# EAGLE design esplay_2.0 (EAGLE 9.2.2)
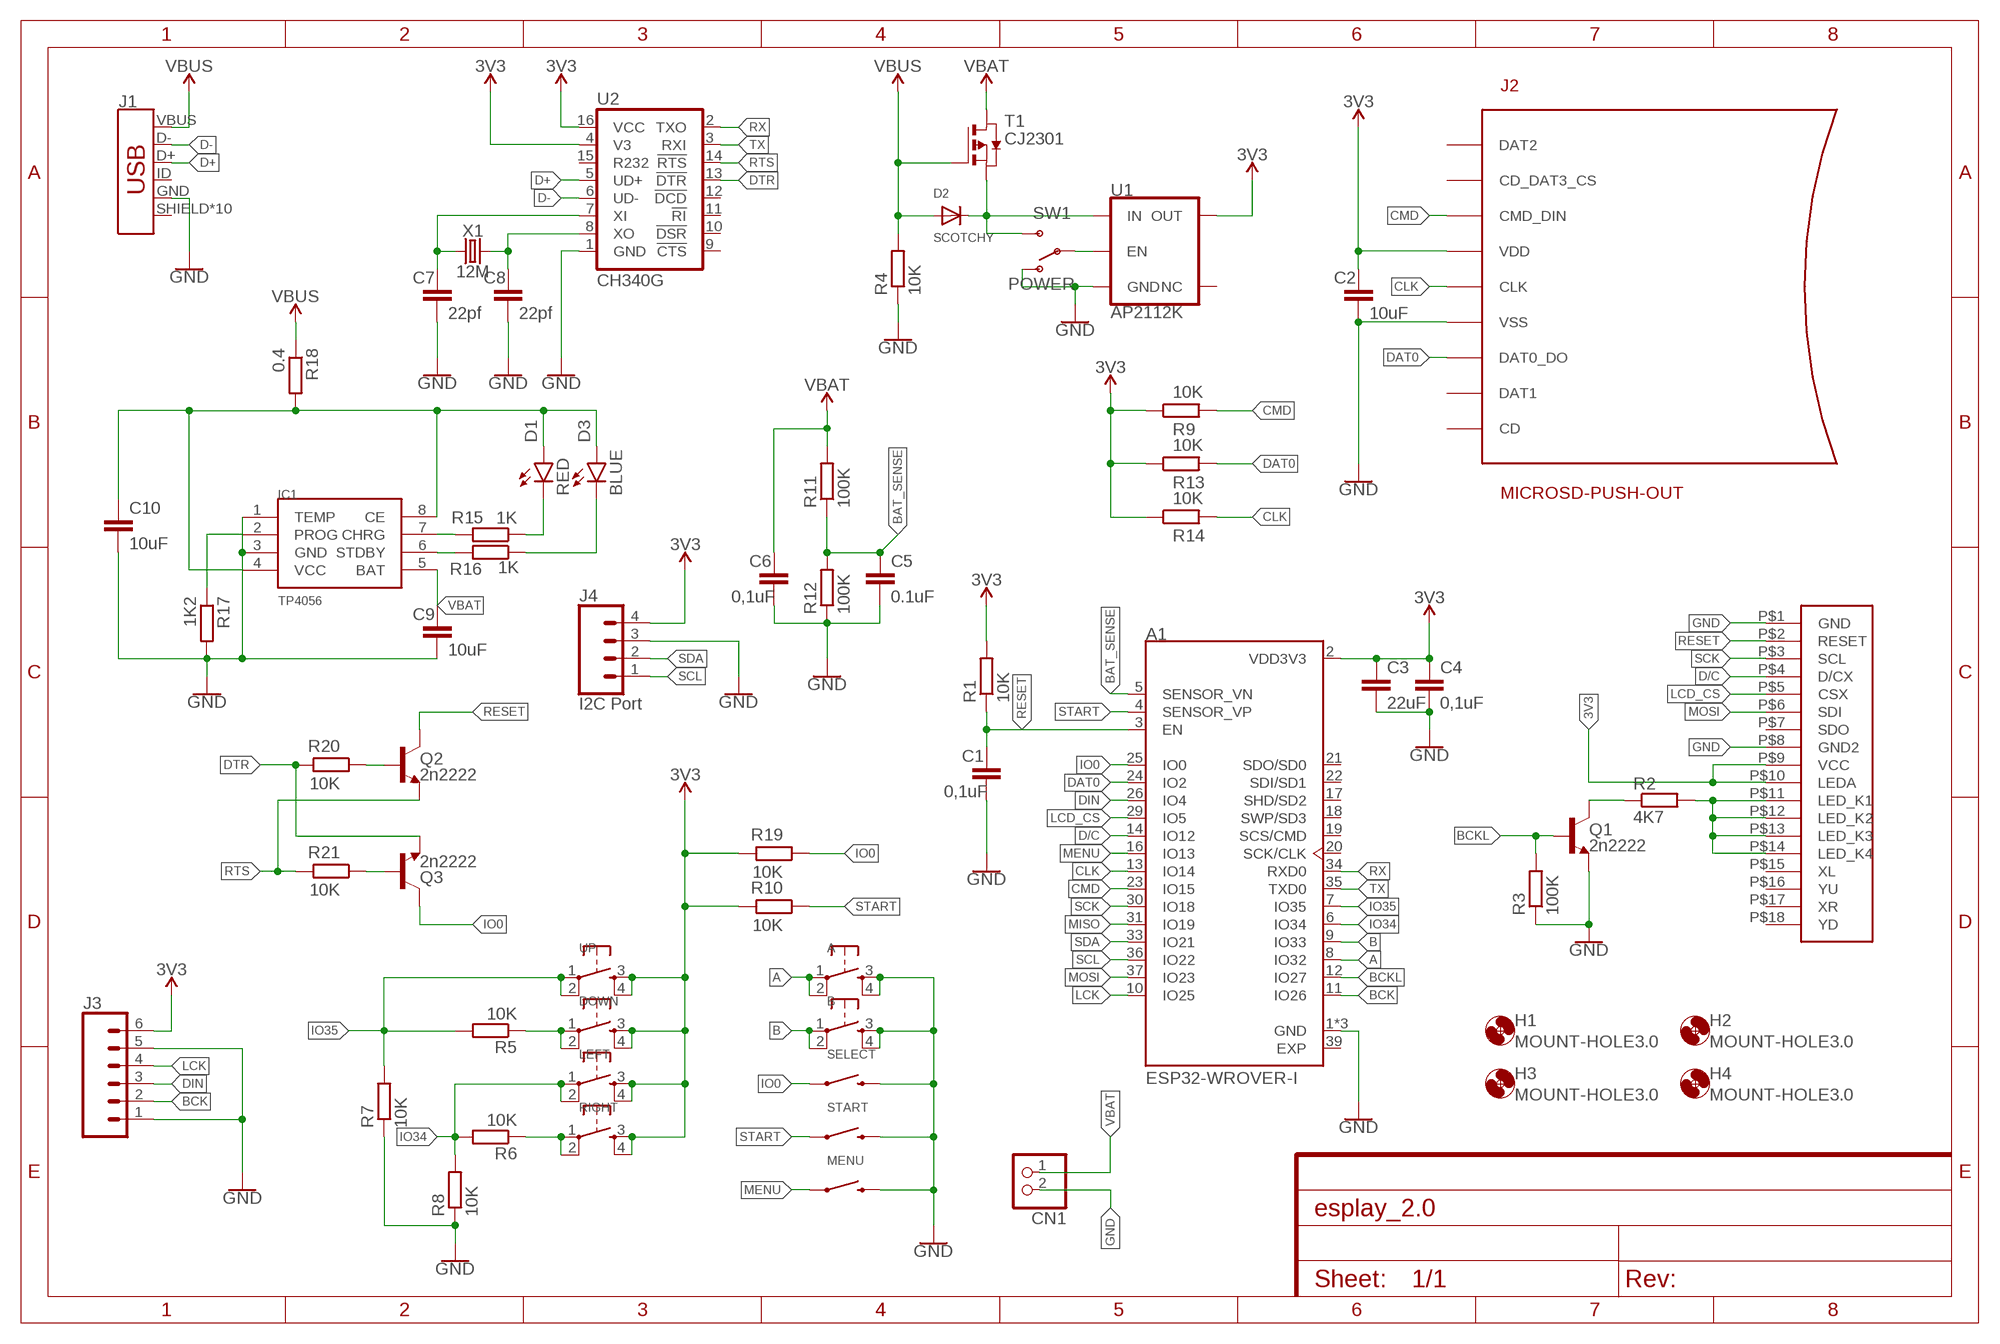
[diagram p0: schematic, sheet 1]

## Parts
A  MOMENTARY-SWITCH-SPST-2-SMD-5.2MM  [TACTILE_SWITCH_SMD_5.2MM]
A1  ESP32-WROVER-I  [XCVR_ESP32-WROVER-I]
B  MOMENTARY-SWITCH-SPST-2-SMD-5.2MM  [TACTILE_SWITCH_SMD_5.2MM]
C1  0,1uF  C  [C0805]
C2  10uF  C  [C0805]
C3  22uF  C  [C0805]
C4  0,1uF  C  [C0805]
C5  0.1uF  C  [C0805]
C6  0,1uF  C  [C0805]
C7  22pf  C  [C0805]
C8  22pf  C  [C0805]
C9  10uF  C  [C0805]
C10  10uF  C  [C0805]
CN1  JST_2PIN-SMT-RA  [JST-PH-2-SMT-RA]
D1  RED  LED-RED0603  [LED-0603]
D2  SCOTCHY  DIODESMA  [SMADIODE]
D3  BLUE  LED-BLUE0603  [LED-0603]
DOWN  MOMENTARY-SWITCH-SPST-2-SMD-5.2MM  [TACTILE_SWITCH_SMD_5.2MM]
H1  MOUNT-HOLE3.0  [3,0]
H2  MOUNT-HOLE3.0  [3,0]
H3  MOUNT-HOLE3.0  [3,0]
H4  MOUNT-HOLE3.0  [3,0]
IC1  TP4056  [SOP-8]
J1  USB_MICRO-B_HALF_PTH_MILL  [USB-MICROB-PTH-MILL]
J2  MICROSD-PUSH-OUT  [MICROSD-PUSH-OUT]
J3  CONN_06LOCK  [1X06_LOCK]
J4  I2C Port  CONN_04JST-PTH  [JST-4-PTH]
LEFT  MOMENTARY-SWITCH-SPST-2-SMD-5.2MM  [TACTILE_SWITCH_SMD_5.2MM]
MENU  MOMENTARY-SWITCH-SPST-SMD-6.0X3.5MM  [TACTILE_SWITCH_SMD_6.0X3.5MM]
Q1  2n2222  TRANS_NPN-MMBT2222AL  [SOT23-3]
Q2  2n2222  TRANS_NPN-MMBT2222AL  [SOT23-3]
Q3  2n2222  TRANS_NPN-MMBT2222AL  [SOT23-3]
R1  10K  R  [R0805]
R2  4K7  R  [R0805]
R3  100K  R  [R0805]
R4  10K  R  [R0805]
R5  10K  R  [R0805]
R6  10K  R  [R0805]
R7  10K  R  [R0805]
R8  10K  R  [R0805]
R9  10K  R  [R0805]
R10  10K  R  [R0805]
R11  100K  R  [R0805]
R12  100K  R  [R0805]
R13  10K  R  [R0805]
R14  10K  R  [R0805]
R15  1K  R  [R0805]
R16  1K  R  [R0805]
R17  1K2  R  [R0805]
R18  0.4  R  [R0805]
R19  10K  R  [R0805]
R20  10K  R  [R0805]
R21  10K  R  [R0805]
RIGHT  MOMENTARY-SWITCH-SPST-2-SMD-5.2MM  [TACTILE_SWITCH_SMD_5.2MM]
SELECT  MOMENTARY-SWITCH-SPST-SMD-6.0X3.5MM  [TACTILE_SWITCH_SMD_6.0X3.5MM]
START  MOMENTARY-SWITCH-SPST-SMD-6.0X3.5MM  [TACTILE_SWITCH_SMD_6.0X3.5MM]
SW1  POWER  SWITCH_SPDT  [KPS-1290]
T1  CJ2301  PMOSSOT23  [SOT-23]
TFT_DISPLAY  ILI9341-2.4  [ILI9341-2.4]
U1  AP2112K  V_REG_AP2112K-3.3V  [SOT23-5]
U2  CH340G  CH340GSMD  [SO016]
UP  MOMENTARY-SWITCH-SPST-2-SMD-5.2MM  [TACTILE_SWITCH_SMD_5.2MM]
X1  12M  CRYSTALSMD-2X6  [CRYSTAL-SMD-2X6-CYL]

## Nets
3V3 [3V3]: A1.2(VDD3V3) C2.1 C3.1 C4.1 DOWN.3 DOWN.4 J2.4(VDD) J3.6 J4.4 LEFT.3 LEFT.4 R1.2 R9.1 R10.2 R13.1 R14.1 R19.2 RIGHT.3 RIGHT.4 TFT_DISPLAY.P$9(VCC) TFT_DISPLAY.P$10(LEDA) U1.5(OUT) U2.4(V3) U2.16(VCC) UP.3 UP.4
A: A1.8(IO32) A.1 A.2
B: A1.9(IO33) B.1 B.2
BAT_SENSE: A1.5(SENSOR_VN) C5.1 R11.1 R12.2
BCK: A1.11(IO26) J3.2
BCKL: A1.12(IO27) Q1.1(B) R3.2
CLK: A1.13(IO14) J2.5(CLK) R14.2
CMD: A1.23(IO15) J2.3(CMD_DIN) R9.2
D+: J1.D+ U2.5(UD+)
D-: J1.D- U2.6(UD-)
D/C: A1.14(IO12) TFT_DISPLAY.P$4(D/CX)
DAT0: A1.24(IO2) J2.7(DAT0_DO) R13.2
DIN: A1.26(IO4) J3.3
DTR: Q3.2(E) R20.2 U2.13(!DTR)
GND: A1.1(GND) A1.15(GND) A1.38(GND) A.3 A.4 B.3 B.4 C1.2 C2.2 C3.2 C4.2 C5.2 C6.2 C7.2 C8.2 C9.2 C10.2 CN1.2 IC1.1(TEMP) IC1.3(GND) J1.GND J2.6(VSS) J2.G1(VSS) J2.G2(VSS) J2.G3(VSS) J2.G4(VSS) J3.1 J3.5 J4.3 MENU.2 Q1.2(E) R3.1 R4.1 R7.1 R8.1 R12.1 R17.2 SELECT.2 START.2 SW1.O TFT_DISPLAY.P$1(GND) TFT_DISPLAY.P$8(GND2) U1.2(GND) U2.1(GND)
IO0: A1.25(IO0) Q3.3(C) R19.1 SELECT.1
IO34: A1.6(IO34) LEFT.1 LEFT.2 R6.2 R8.2
IO35: A1.7(IO35) R5.2 R7.2 UP.1 UP.2
LCD_CS: A1.29(IO5) TFT_DISPLAY.P$5(CSX)
LCK: A1.10(IO25) J3.4
MENU: A1.16(IO13) MENU.1
MISO: A1.31(IO19)
MOSI: A1.37(IO23) TFT_DISPLAY.P$6(SDI)
N$1: D2.C SW1.S T1.2(S) U1.1(IN)
N$2: R2.2 TFT_DISPLAY.P$11(LED_K1) TFT_DISPLAY.P$12(LED_K2) TFT_DISPLAY.P$13(LED_K3) TFT_DISPLAY.P$14(LED_K4)
N$3: SW1.P U1.3(EN)
N$4: Q1.3(C) R2.1
N$5: C7.1 U2.7(XI) X1.X1
N$6: C8.1 U2.8(XO) X1.X2
N$7: R6.1 RIGHT.1 RIGHT.2
N$8: DOWN.1 DOWN.2 R5.1
N$9: IC1.2(PROG) R17.1
N$10: IC1.7(CHRG) R15.2
N$11: IC1.6(STDBY) R16.2
N$12: D1.C R15.1
N$13: D3.C R16.1
N$14: C10.1 D1.A D3.A IC1.4(VCC) IC1.8(CE) R18.2
N$15: Q2.1(B) R20.1
N$16: Q3.1(B) R21.1
RESET: A1.3(EN) C1.1 Q2.3(C) R1.1 TFT_DISPLAY.P$2(RESET)
RTS: Q2.2(E) R21.2 U2.14(!RTS)
RX: A1.34(RXD0) U2.2(TXO)
SCK: A1.30(IO18) TFT_DISPLAY.P$3(SCL)
SCL: A1.36(IO22) J4.1
SDA: A1.33(IO21) J4.2
START: A1.4(SENSOR_VP) R10.1 START.1
TX: A1.35(TXD0) U2.3(RXI)
VBAT [3V3]: C6.1 C9.1 CN1.1 IC1.5(BAT) R11.2 T1.1(D)
VBUS [VBUS]: D2.A J1.VBUS R4.2 R18.1 T1.3(G)
Unconnected: A1.17(SHD/SD2) A1.18(SWP/SD3) A1.19(SCS/CMD) A1.20(SCK/CLK) A1.21(SDO/SD0) A1.22(SDI/SD1) J1.ID J1.SHIELD J1.SHIELD2(SHIELD) J1.SHIELD3(SHIELD) J1.SHIELD4(SHIELD) J1.SHIELD5(SHIELD) J1.SHIELD6(SHIELD) J1.SHIELD7(SHIELD) J1.SHIELD8(SHIELD) J1.SHIELD9(SHIELD) J1.SHIELD10(SHIELD) J2.1(DAT2) J2.2(CD_DAT3_CS) J2.8(DAT1) J2.CD TFT_DISPLAY.P$7(SDO) TFT_DISPLAY.P$15(XL) TFT_DISPLAY.P$16(YU) TFT_DISPLAY.P$17(XR) TFT_DISPLAY.P$18(YD) U1.4(NC) U2.9(!CTS) U2.10(!DSR) U2.11(!RI) U2.12(!DCD) U2.15(R232)

## Power pins joined to a net without a drawn wire
EXP: A1.39(EXP)

## Library data of the parts
A B DOWN LEFT RIGHT UP = SparkFun-Switches:MOMENTARY-SWITCH-SPST-2: Momentary Switch (Pushbutton) - SPST - Two Circuits Normally-open (NO) SPST momentary switches (buttons, pushbuttons). Schematic symbol includes two switch circuits. Variants SMD-4.6MMX2.8MM - 4.60mm x 2.80mm Tactile Momentary Button Switch - Used on SparkFun SAMD21 Mini Breakout <https://www.sparkfun.com/products/13664> SMD-5.2MM - Mini Pushbutton Switch - SMD <https://www.sparkfun.com/products/8720> - Used on Arduino Pro Mini <https://www.sparkfun.com/products/11114>; PROD_ID: SWCH-08247; SF_SKU: COM-08720
A1 = ESP32-WROVER-I:ESP32-WROVER-I: Module: combo; GPIO, I2C x2, I2S x2, SDIO, SPI x3, UART x3; U.FL; AVAILABILITY: Unavailable; DESCRIPTION: Module: combo; GPIO, I2C x2, I2S x2, SDIO, SPI x3, UART x3; U.FL; MF: Espressif Systems; MP: ESP32-WROVER-I; PACKAGE: Module Espressif Systems; PRICE: None
C1-C10 = eagle-ltspice:C: CAPACITOR, European symbol; SPICEMODEL: NONE; SPICEPREFIX: C
CN1 = adafruit:JST_2PIN: JST 2-Pin Connectors of various flavors SMT-RA (S2B-PH-SM4) 4UConnector #17311 SMT (B2B-PH-SM4) THM-RA (S2B-PH) THM (B2B-PH)
D1 = SparkFun-LED:LED-RED: Red SMD LED Used in manufacturing of most products at SparkFun Packages: 0603 - SMD 0603 package [Product Link] <http://docs.avagotech.com/docs/AV02-0551EN> 0603 SMART - SMD 0603 SMART package ( more efficient and expensive)[Product Link] <http://www.osram-os.com/Graphics/XPic2/00077099_0.pdf> 1206 - SMD1206 package [Product Link] <https://www.sparkfun.com/datasheets/DevTools/LilyPad/Q150OVS4.pdff> SparkFun Products: Pro Mini 328 -5V <https://www.sparkfun.com/products/821> RedBoard <https://www.sparkfun.com/products/12757> IOIO-OTG <https://www.sparkfun.com/products/13613>; PROD_ID: DIO-00819
D2 = adafruit:DIODE: Diode SMADIODE - SMA Surface Mount Package 20V 1A Schottky Diode Digikey: 641-1014-6-ND DO-1N4148 - Through Hole Small Current Diode SOD-123 20V 1 A (.5mV Vf) Schottky Diode - Digikey: MBRX120TPMSCT-ND SOD-323 10V 570mA (.38mV Vf, 3ns) Schottky Diode - Digikey: ZLLS410CT-ND SOD-523 30V 30mA Schottky Diode (RB751S-40TE61) - Digikey: RB751S-40TE61CT-ND SOT23-R/W - SOT23 Package (R = Solder Paste/Reflow Ovens, W = Hand-Soldering) BAT54Film 40V 300mA - Digikey: 497-7162-1-ND
D3 = SparkFun-LED:LED-BLUE: Blue SMD LED Used in manufacturing of various products at SparkFun Packages: 0603 - SMD 0603 package [Product Link] <http://www.digikey.com/product-detail/en/SMLE12BC7TT86/511-1589-2-ND/1641808> 1206 - SMD1206 package [Product Link] <http://www.digikey.com/product-detail/en/lite-on-inc/LTST-C150TBKT/160-1643-1-ND/573584> SparkFun Products: ESP8266 Thing-Dev Board <https://www.sparkfun.com/products/13711> RedBoard <https://www.sparkfun.com/products/12757>; PROD_ID: DIO-08575
H1-H4 = holes:MOUNT-HOLE: MOUNTING HOLE with drill center marker
IC1 = TP4056:TP4056
J1 = SparkFun-Connectors:USB_MICRO-B: USB Type Micro-B Connector Male/female and PTH/SMT variants SparkFun Products: SparkFun microB USB Breakout <https://www.sparkfun.com/products/12035> SparkFun USB microB Plug Breakout <https://www.sparkfun.com/products/10031> SparkFun ESP8266 Thing <https://www.sparkfun.com/products/13231>; PROD_ID: CONN-13711
J2 = microsd:MICROSD-PUSH-OUT: T-Flash Push-Out Micro SD Card Reader 14.75mm x 14.5mm SMD with external pins
J3 = SparkFun-Connectors:CONN_06: Multi connection point. Often used as Generic Header-pin footprint for 0.1 inch spaced/style header connections On any of the 0.1 inch spaced packages, you can populate with these: Break Away Headers - Straight <https://www.sparkfun.com/products/116> (PRT-00116) Break Away Male Headers - Right Angle <https://www.sparkfun.com/products/553> (PRT-00553) Female Headers <https://www.sparkfun.com/products/115> (PRT-00115) Break Away Headers - Machine Pin <https://www.sparkfun.com/products/117> (PRT-00117) Break Away Female Headers - Swiss Machine Pin <https://www.sparkfun.com/products/743> (PRT-00743) Arduino Stackable Header - 6 Pin <https://www.sparkfun.com/products/9280> (PRT-09280) For SCREWTERMINALS and SPRING TERMINALS visit here: Screw Terimnals on SparkFun.com <https://www.sparkfun.com/search/results?term=Screw+Terminals> (5mm/3.5mm/2.54mm spacing) This device is also useful as a general connection point to wire up your design to another part of your project. Our various solder wires solder well into these plated through hole pads. Hook-Up Wire - Assortment (Stranded, 22 AWG) <https://www.sparkfun.com/products/11375> (PRT-11375) Hook-Up Wire - Assortment (Solid Core, 22 AWG) <https://www.sparkfun.com/products/11367> (PRT-11367) View the entire wire category on our website here <https://www.sparkfun.com/categories/141>
J4 = SparkFun-Connectors:CONN_04: Multi connection point. Often used as Generic Header-pin footprint for 0.1 inch spaced/style header connections On any of the 0.1 inch spaced packages, you can populate with these: Break Away Headers - Straight <https://www.sparkfun.com/products/116> (PRT-00116) Break Away Male Headers - Right Angle <https://www.sparkfun.com/products/553> (PRT-00553) Female Headers <https://www.sparkfun.com/products/115> (PRT-00115) Break Away Headers - Machine Pin <https://www.sparkfun.com/products/117> (PRT-00117) Break Away Female Headers - Swiss Machine Pin <https://www.sparkfun.com/products/743> (PRT-00743) For SCREWTERMINALS and SPRING TERMINALS visit here: Screw Terimnals on SparkFun.com <https://www.sparkfun.com/search/results?term=Screw+Terminals> (5mm/3.5mm/2.54mm spacing) This device is also useful as a general connection point to wire up your design to another part of your project. Our various solder wires solder well into these plated through hole pads. Hook-Up Wire - Assortment (Stranded, 22 AWG) <https://www.sparkfun.com/products/11375> (PRT-11375) Hook-Up Wire - Assortment (Solid Core, 22 AWG) <https://www.sparkfun.com/products/11367> (PRT-11367) View the entire wire category on our website here <https://www.sparkfun.com/categories/141> Special notes: Molex polarized connector foot print use with SKU : PRT-08231 with associated crimp pins and housings. 1MM SMD Version SKU: PRT-10208; PROD_ID: WIRE-13531; SF_ID: PRT-09916
MENU SELECT START = SparkFun-Switches:MOMENTARY-SWITCH-SPST: Momentary Switch (Pushbutton) - SPST Normally-open (NO) SPST momentary switches (buttons, pushbuttons). Variants PTH-12MM - 12mm square, through-hole Momentary Pushbutton Switch - 12mm Square <https://www.sparkfun.com/products/9190> (COM-09190) PTH-6.0MM, PTH-6.0MM-KIT - 6.0mm square, through-hole Mini Pushbutton Switch <https://www.sparkfun.com/products/97> (COM-00097) KIT package intended for soldering kit's - only one side of pads' copper is exposed. PTH-RIGHT-ANGLE-KIT - Right-angle, through-hole Right Angle Tactile Button <https://www.sparkfun.com/products/10791> - Used on SparkFun BigTime Watch Kit <https://www.sparkfun.com/products/11734> SMD-12MM - 12mm square, surface-mount Tactile Button - SMD (12mm) <https://www.sparkfun.com/products/12993> (COM-12993) Used on SparkFun PicoBoard <https://www.sparkfun.com/products/11888> SMD-4.5MM - 4.5mm Square Trackball Switch Used on SparkFun Blackberry Trackballer Breakout <https://www.sparkfun.com/products/13169> SMD-4.6MMX2.8MM - 4.60mm x 2.80mm, surface mount Used on SparkFun SAMD21 Mini Breakout <https://www.sparkfun.com/products/13664> SMD-5.2MM, SMD-5.2-REDUNDANT - 5.2mm square, surface-mount Mini Pushbutton Switch - SMD <https://www.sparkfun.com/products/8720> (COM-08720) Used on Arduino Pro Mini <https://www.sparkfun.com/products/11114> REDUNDANT package connects both switch circuits together SMD-6.0X3.5MM - 6.0 x 3.5mm, surface mount Momentary Reset Switch SMD <https://www.sparkfun.com/products/8229> (COM-08229) SMD-6.2MM-TALL - 6.2mm square, surface mount Tactile Button - SMD (6mm) <https://www.sparkfun.com/products/12992> Used on SparkFun Digital Sandbox <https://www.sparkfun.com/products/12651> SMD-RIGHT-ANGLE - Right-angle, surface mount Used on SparkFun Block for Intel® Edison - Arduino <https://www.sparkfun.com/products/13036>; PROD_ID: SWCH-00815; SF_SKU: COM-08229
Q1-Q3 = SparkFun-DiscreteSemi:TRANS_NPN: NPN transistor Current controlled devices typically used to amplify current or used as a switch. BC547 - COM-08928 <http://www.sparkfun.com/products/8928> (TO-92 45V 100mA) (1.Collector 2.Base 3.Emitter) 2N3904 - COM-00521 <http://www.sparkfun.com/products/521> (TO-92 40V 200mA) (1.Emitter 2.Base 3.Collector) P2N2222A - COM-12852 <http://www.sparkfun.com/products/12852> (TO-92 40V 600mA) (1.Collector 2.Base 3.Emitter); PROD_ID: TRANS-08049; VALUE: 600mA/40V
R1-R21 = eagle-ltspice:R: RESISTOR, European symbol; SPICEMODEL: NONE; SPICEPREFIX: R
SW1 = SparkFun-Retired:SWITCH_SPDT: SWCH-10651 Side-actuated SPDT slide switch, as used on the Arduino Pro; PROD_ID: SWCH-10651
T1 = zetex:PMOSSOT23: MOS FET; OC_FARNELL: unknown; OC_NEWARK: unknown
TFT_DISPLAY = TFTDisplays:ILI9341-2.4
U1 = SparkFun-IC-Power:V_REG_AP2112: AP2112 - 600mA CMOS LDO Regulator w/ Enable The AP2112 is CMOS process low dropout linear regulator with enable function, the regulator delivers a guaranteed 600mA (min.) continuous load current. Features Output Voltage Accuracy: ±1.5% Output Current: 600mA (Min.) Foldback Short Current Protection: 50mA Enable Function to Turn ON/OFF VOUT Low Dropout Voltage (3.3V): 250mV (Typ.) @IOUT=600mA Excellent Load Regulation: 0.2%/A (Typ.) Excellent Line Regulation: 0.02%/V (Typ.) Low Quiescent Current: 55μA (Typ.) Low Standby Current: 0.01μA (Typ.) Low Output Noise: 50μVRMS PSRR: 100Hz -65dB, 1kHz -65dB OTSD Protection Stable with 1.0μF Flexible Cap: Ceramic, Tantalum and Aluminum Electrolytic Operation Temperature Range: -40°C to 85°C ESD: MM 400V, HBM 4000V; PROD_ID: VREG-12457; VALUE: 3.3V
U2 = SparkFun-IC-Comms:CH340G: A simple USB 2.0 to Serial IC.; PROD_ID: IC-13498
X1 = SparkFun-Clocks:CRYSTAL: Crystals (Generic) These are passive quartz crystals, which can be used as a clock source for a microcontroller. Crystal's are two-terminal devices. They require external "load" capacitors to generate an oscillating signal.

## Net classes
0 default: width 0.305 mm
1 VBUS: width 0.406 mm
2 3V3: width 0.406 mm

## Board
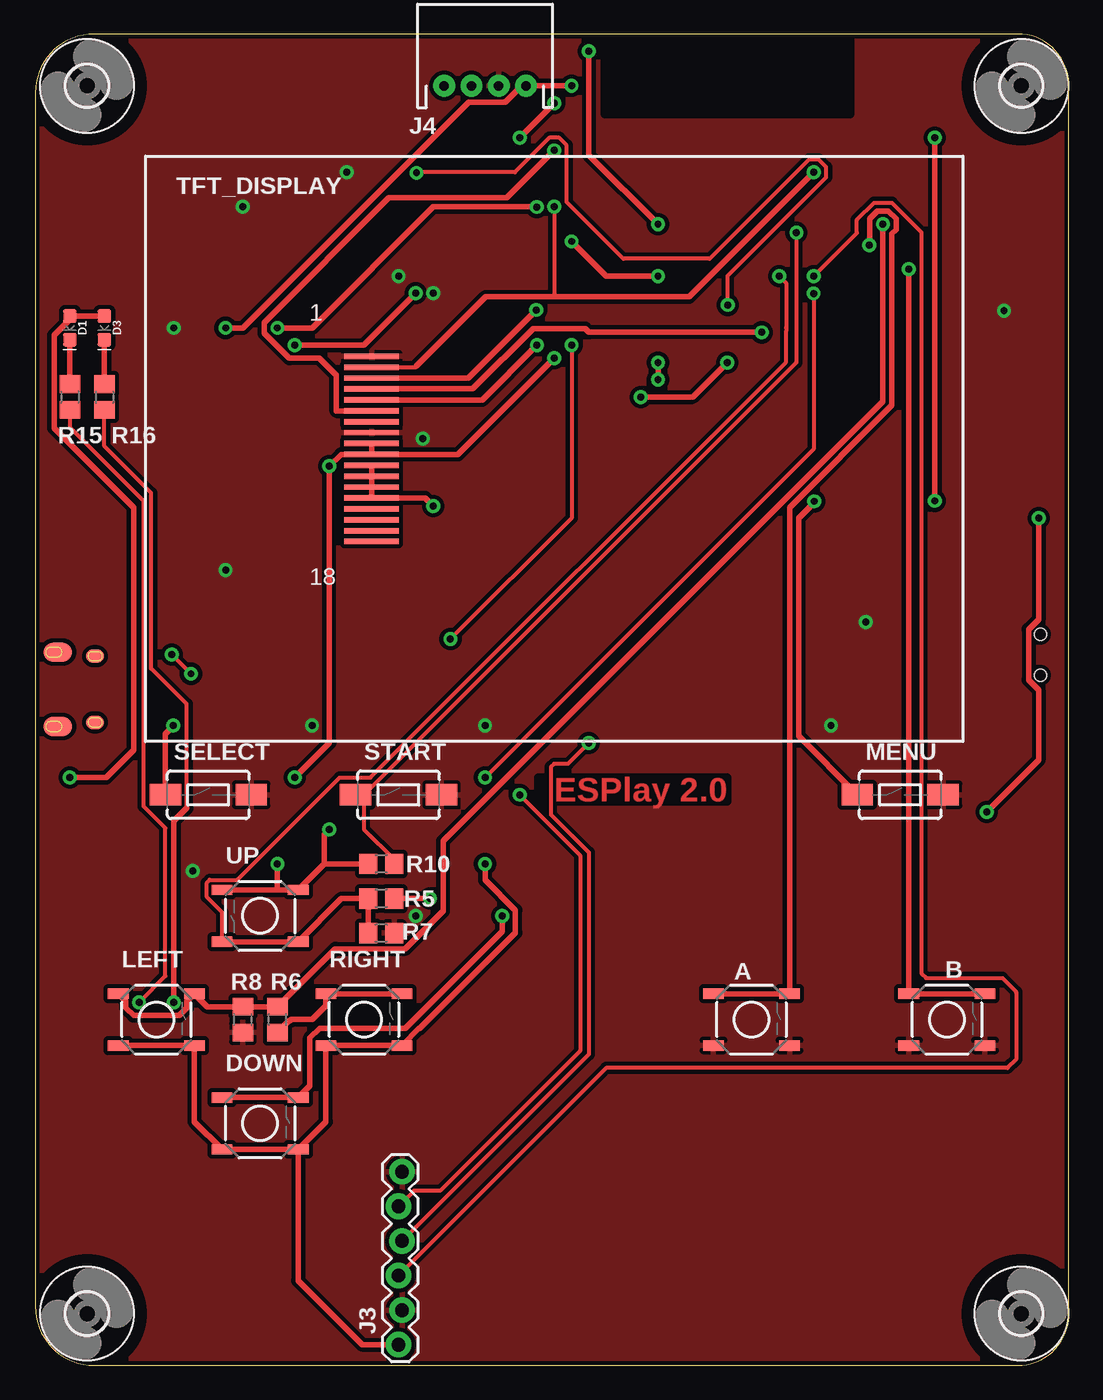
[diagram p1: board, top side]
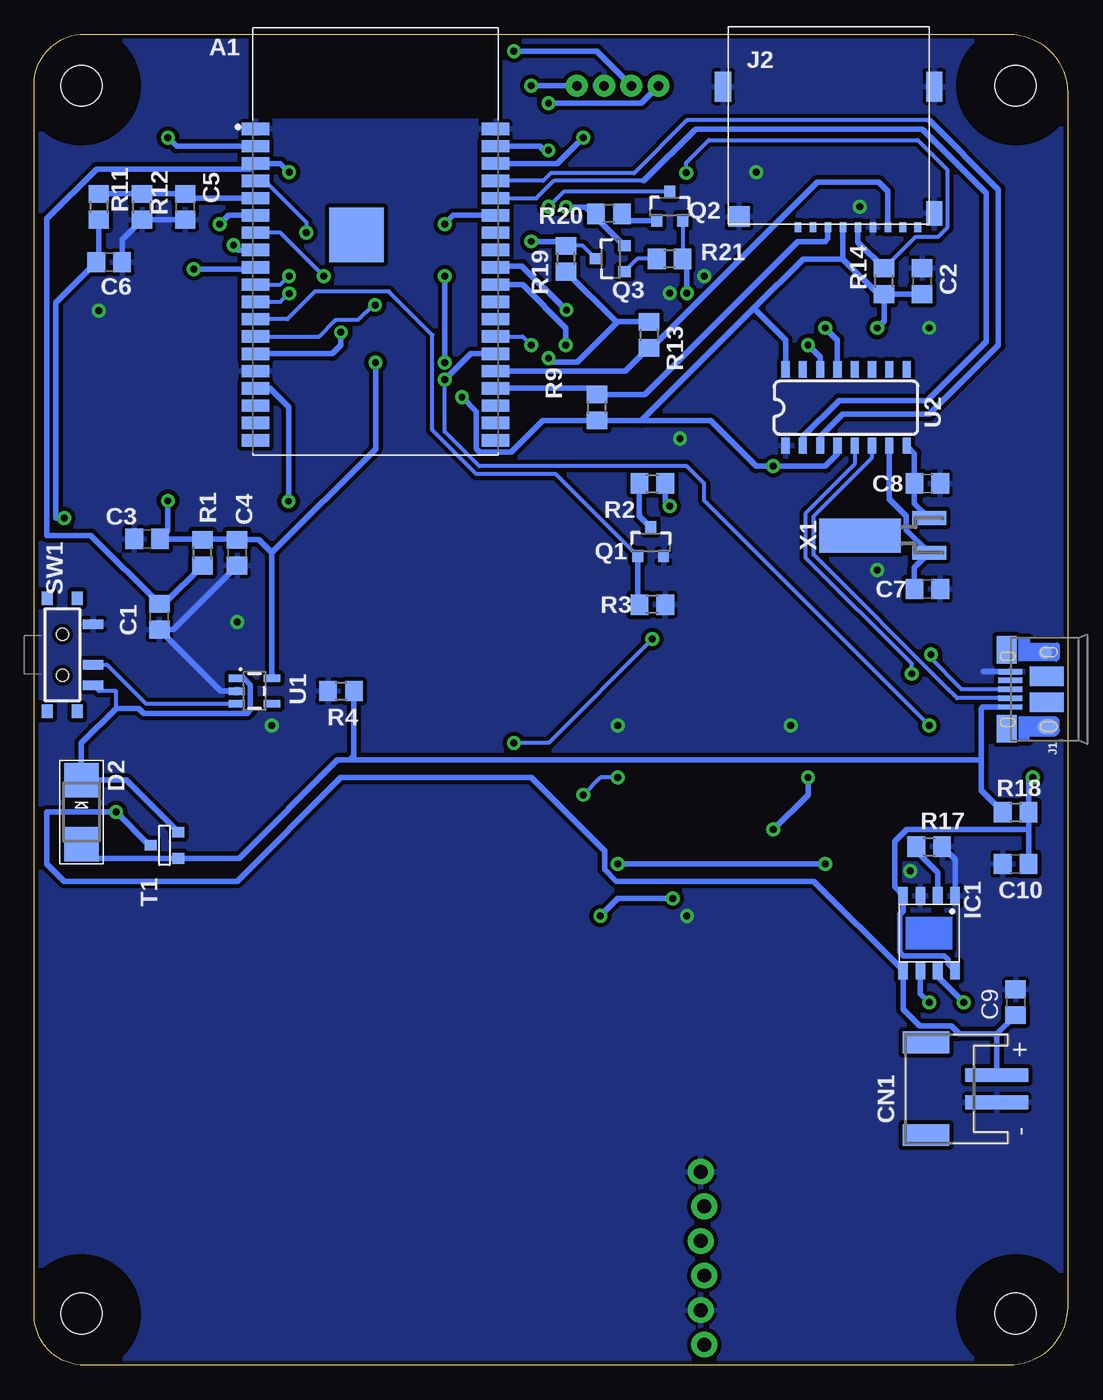
[diagram p2: board, bottom side, seen from below]

Size 75.87 x 97.78 mm. Coordinates in mm from the lower left corner, seen from the top.
Outline: 4.34,0 72.11,0 arc90 75.87,3.75 75.87,94.04 arc90 72.13,97.78 4.32,97.78 arc90 0,93.46 0,4.34 arc90 4.34,0
Copper layers (1*16): Top 0.035mm / dielectric 1.5mm / Bottom 0.035mm
Design rules "SparkFun-2-layer-STANDARD": minimum track width 10mil, minimum drill 20mil, track to track 10mil, track to pad 8mil, pad to pad 8mil, via to via 10mil, smd to smd 8mil, copper to edge 8mil, drill to drill 8mil, minimum pad ring 10mil, minimum via ring 10mil, stop-mask expansion 4mil, vias tented up to drill 25mil, thermal gap 10mil

### Footprints (pad centres in the part's own frame; a part is rotated, then mirrored left to right if it is on the bottom)
TACTILE_SWITCH_SMD_5.2MM = smd 1.524 x 0.762: 1 -2.794,1.905; 2 2.794,1.905; 3 -2.794,-1.905; 4 2.794,-1.905
XCVR_ESP32-WROVER-I = smd 2 x 0.9: 1 -8.81,8.26; 2 -8.81,6.99; 3 -8.81,5.72; 4 -8.81,4.45; 5 -8.81,3.18; 6 -8.81,1.91; 7 -8.81,0.64; 8 -8.81,-0.63; 9 -8.81,-1.9; 10 -8.81,-3.17; 11 -8.81,-4.44; 12 -8.81,-5.71; 13 -8.81,-6.98; 14 -8.81,-8.25; 15 -8.81,-9.52; 16 -8.81,-10.79; 17 -8.81,-12.06; 18 -8.81,-13.33; 19 -8.81,-14.6; 20 8.81,-14.6; 21 8.81,-13.33; 22 8.81,-12.06; 23 8.81,-10.79; 24 8.81,-9.52; 25 8.81,-8.25; 26 8.81,-6.98; 27 8.81,-5.71; 28 8.81,-4.44; 29 8.81,-3.17; 30 8.81,-1.9; 31 8.81,-0.63; 32 8.81,0.64; 33 8.81,1.91; 34 8.81,3.18; 35 8.81,4.45; 36 8.81,5.72; 37 8.81,6.99; 38 8.81,8.26 | smd 4 x 4: 39 -1.38,0.47
C0805 = smd 1.3 x 1.5: 1 -0.95,0; 2 0.95,0
JST-PH-2-SMT-RA = smd 1 x 4.6: 1 1,-3.7; 2 -1,-3.7 | smd 1.6 x 3.4: NC1 -3.4,1.5; NC2 3.4,1.5
LED-0603 = smd 1 x 1: A -0.877,0; C 0.877,0
SMADIODE = smd 2.54 x 2.54: A 2.349,0; C -2.349,0
3,0 = hole 3: 0,0
SOP-8 = smd 1.3 x 0.7: 1 -2.75,1.905; 2 -2.75,0.635; 3 -2.75,-0.635; 4 -2.75,-1.905; 5 2.75,-1.905; 6 2.75,-0.635; 7 2.75,0.635; 8 2.75,1.905
USB-MICROB-PTH-MILL = smd 0.4 x 1.75: D+ 0,0; D- -0.65,0; GND 1.3,0; ID 0.65,0; VBUS -1.3,0 | smd 2 x 1.46: SHIELD -2.9,0.275; SHIELD2 2.9,0.275 | smd 1.425 x 2.5: SHIELD3 -0.963,-2.675; SHIELD4 0.963,-2.675 | smd 1.4 x 2.1 bottom: SHIELD5 -2.731,-2.531; SHIELD7 2.729,-2.531 | smd 1 x 1: SHIELD6 2.7,-2.575 | smd 1.1 x 1.5: SHIELD8 -2.731,-2.731 | smd 1 x 1.3 bottom: SHIELD9 -2.43,0.195; SHIELD10 2.43,0.195
MICROSD-PUSH-OUT = smd 0.5 x 0.75: 1 9.625,0.225; 2 8.525,0.225; 3 7.425,0.225; 4 6.325,0.225; 5 5.225,0.225; 6 4.125,0.225; 7 3.025,0.225; 8 1.925,0.225; CD 0.825,0.225 | smd 1.2 x 1.8: G1 -0.375,-0.8 | smd 1.2 x 2.2: G2 -0.375,-10.1; G4 15.125,-10.1 | smd 1.6 x 1.5: G3 13.95,-0.55
1X06_LOCK = drill 1.016 pad 1.88: 1 0,0; 2 2.54,-0.254; 3 5.08,0; 4 7.62,-0.254; 5 10.16,0; 6 12.7,-0.254
JST-4-PTH = drill 0.7 pad 1.6: 1 -3,0; 2 -1,0; 3 1,0; 4 3,0
TACTILE_SWITCH_SMD_6.0X3.5MM = smd 2.3 x 1.6: 1 -3.15,0; 2 3.15,0
SOT23-3 = smd 0.8 x 0.9: 1 -0.95,-1; 2 0.95,-1; 3 0,1.1
R0805 = smd 1.3 x 1.5: 1 -0.95,0; 2 0.95,0
KPS-1290 = smd 0.7 x 1.5: O -2.25,2.25; P 0.75,2.25; S 2.25,2.25 | smd 1 x 0.8: P$1 -4.15,1.1; P$2 -4.15,-1.1; P$3 4.15,-1.1; P$4 4.15,1.1 | hole 0.9: -1.5,0; 1.5,0
SOT-23 = smd 0.787 x 0.889: 1 0.025,-1.016; 2 -0.94,1.016; 3 0.991,1.016
ILI9341-2.4 = smd 4 x 0.4: P$1 -13.4,6.8; P$2 -13.4,6; P$3 -13.4,5.2; P$4 -13.4,4.4; P$5 -13.4,3.6; P$6 -13.4,2.8; P$7 -13.4,2; P$8 -13.4,1.2; P$9 -13.4,0.4; P$10 -13.4,-0.4; P$11 -13.4,-1.2; P$12 -13.4,-2; P$13 -13.4,-2.8; P$14 -13.4,-3.6; P$15 -13.4,-4.4; P$16 -13.4,-5.2; P$17 -13.4,-6; P$18 -13.4,-6.8
SOT23-5 = smd 0.55 x 1.2: 1 -0.95,-1.3; 2 0,-1.3; 3 0.95,-1.3; 4 0.95,1.3; 5 -0.95,1.3
SO016 = smd 0.6 x 1.2: 1 -4.445,-2.8; 2 -3.175,-2.8; 3 -1.905,-2.8; 4 -0.635,-2.8; 5 0.635,-2.8; 6 1.905,-2.8; 7 3.175,-2.8; 8 4.445,-2.8; 9 4.445,2.8; 10 3.175,2.8; 11 1.905,2.8; 12 0.635,2.8; 13 -0.635,2.8; 14 -1.905,2.8; 15 -3.175,2.8; 16 -4.445,2.8
CRYSTAL-SMD-2X6-CYL = smd 2.5 x 6: SHEILD 0,5.08 | smd 1 x 2.5: X1 -1.27,0; X2 1.27,0

### Placement (x,y rotation side)
A  52.58,25.4 0 top
A1  50.8,82.55 0 bottom
B  66.93,25.4 0 top
C1  66.67,54.99 270 bottom
C2  10.67,79.63 90 bottom
C3  67.56,60.71 180 bottom
C4  60.96,59.69 270 bottom
C5  64.77,85.09 270 bottom
C6  70.36,81.03 0 bottom
C7  10.29,57.02 0 bottom
C8  10.29,64.77 0 bottom
C9  3.81,26.67 90 bottom
C10  3.81,36.83 180 bottom
CN1  8.89,20.32 90 bottom
D1  2.54,76.2 270 top
D2  72.39,40.64 270 bottom
D3  5.08,76.2 270 top
DOWN  16.51,17.78 0 top
H1  3.81,3.81 0 top
H2  3.81,93.98 0 top
H3  72.39,3.81 0 top
H4  72.39,93.98 0 top
IC1  10.16,31.75 270 bottom
J1  4.19,49.66 90 bottom
J2  10.16,83.82 180 bottom
J3  26.92,14.22 270 top
J4  33.02,93.98 0 top
LEFT  8.89,25.4 0 top
MENU  63.5,41.91 0 top
Q1  30.61,60.45 0 bottom
Q2  29.21,85.09 0 bottom
Q3  33.53,81.28 90 bottom
R1  63.5,59.69 90 bottom
R2  30.48,64.77 0 bottom
R3  30.48,55.88 180 bottom
R4  53.34,49.53 0 bottom
R5  25.4,34.29 180 top
R6  17.78,25.4 90 top
R7  25.4,31.75 180 top
R8  15.24,25.4 90 top
R9  34.54,70.36 90 bottom
R10  25.4,36.83 180 top
R11  71.12,85.09 270 bottom
R12  67.94,85.09 90 bottom
R13  30.73,75.69 270 bottom
R14  13.46,79.63 90 bottom
R15  2.54,71.12 270 top
R16  5.08,71.12 270 top
R17  10.16,38.1 0 bottom
R18  3.81,40.64 0 bottom
R19  36.83,81.28 270 bottom
R20  33.66,84.58 180 bottom
R21  29.21,81.28 0 bottom
RIGHT  24.13,25.4 0 top
SELECT  12.7,41.91 0 top
START  26.67,41.91 0 top
SW1  73.79,52.2 270 bottom
T1  66.29,38.23 270 bottom
TFT_DISPLAY  38.1,67.31 0 top
U1  59.69,49.53 270 bottom
U2  16.26,70.36 0 bottom
UP  16.51,33.02 180 top
X1  10.16,60.96 90 bottom

### Tracks (layer width: path | path; a pad name or v marks a point on that pad's centre or on a via)
3V3  (via drill 0.51)
  Top 0.406: TFT_DISPLAY.P$10 TFT_DISPLAY.P$9 | TFT_DISPLAY.P$10 22.46,66.91 v21.59,66.04 21.59,45.72 v19.05,43.18 | v13.97,76.2 15.24,76.2 31.81,92.77 34.52,92.77 35.73,93.98 v39.37,93.98 | UP.4 17.78,34.92 | 17.78,34.92 UP.3 21.21,36.83 | 21.21,36.83 R10.2 | LEFT.3 LEFT.4 11.68,17.91 DOWN.3 DOWN.4 | DOWN.4 21.34,17.91 RIGHT.3 RIGHT.4 28.17,24.74 28.21,24.74 35.26,31.78 35.26,33.42 33.02,35.66 v33.02,36.83 | DOWN.4 19.3,6.22 24,1.52 J3.6 | v66.04,90.17 v66.04,63.5 | 21.21,36.83 21.21,38.99 v21.59,39.37 | v44.45,71.12 48.26,71.12 v50.8,73.66 | v38.1,73.99 31.02,66.91 TFT_DISPLAY.P$10 | v17.78,36.83 17.78,34.92
  Bottom 0.406: J2.4 16.48,81.25 | R14.1 13.91,78.68 16.48,81.25 | C2.1 R14.1 | U2.4 16.89,66.93 17.78,66.04 v21.59,66.04 22.86,66.04 26.21,69.39 31.28,69.39 | R19.2 33.14,76.64 33.02,76.64 | 33.02,76.64 R13.1 | J4.4 v39.37,93.98 | v13.97,76.2 13.46,76.71 R14.1 | R1.2 63.57,60.71 | 63.57,60.71 C3.1 66.04,61.28 v66.04,63.5 | 63.57,60.71 61.03,60.71 C4.1 59.37,60.64 58.42,59.69 | 58.42,59.69 58.42,50.8 58.39,50.77 U1.5 | A1.2 65.41,89.54 v66.04,90.17 | v21.59,39.37 19.05,41.91 v19.05,43.18 | v44.45,71.12 43.4,70.07 43.4,67.33 43.16,67.09 40.82,67.09 38.51,69.41 R9.1 34.52,69.39 31.28,69.39 | v50.8,73.66 50.8,67.31 58.42,59.69 | 33.02,76.64 35.98,73.69 38.1,73.69 v38.1,73.99 | v33.02,36.83 v17.78,36.83 | 16.48,81.25 19.41,81.25 23.03,77.64 | 23.03,77.64 31.28,69.39 | U2.16 20.7,75.31 23.03,77.64
A  (via drill 0.51)
  Top 0.406: A.1 A.2 55.37,63.01 62.89,70.53 62.89,83.11 63.2,83.42 63.2,84.22 62.63,84.78 61.83,84.78 61.27,84.22 61.27,82.32 v61.23,82.28
  Bottom 0.406: v61.23,82.28 60.87,81.92 A1.8
B  (via drill 0.51)
  Top 0.406: B.2 B.1 v64.14,80.52
  Bottom 0.406: v64.14,80.52 59.74,80.52 A1.9
BAT_SENSE
  Bottom 0.406: A1.5 64.46,85.73 C5.1 R12.2 R11.1
BCK  (via drill 0.51)
  Top 0.305: v57.14,78.73 57.14,67.3 v33.02,43.18 | v35.56,41.91 40.01,37.47 40.01,23.11 29.72,12.83 27.81,12.83 J3.2
  Bottom 0.305: A1.11 57.78,78.11 v57.15,78.74 v57.14,78.73 | v35.56,41.91 34.29,43.18 v33.02,43.18
BCKL
  Bottom 0.305: Q1.1 37.59,65.48 43.41,65.48 46.63,68.7 46.63,75.67 49.83,78.87 55.24,78.87 57.28,76.83 A1.12
  Bottom 0.406: R3.2 31.56,56.01 Q1.1
CLK  (via drill 0.51)
  Top 0.305: v50.83,77.89 50.83,80.02 58.06,87.25 58.06,88.01 57.53,88.54 56.77,88.54 49.51,81.28 43.18,81.28 39.01,85.45 39.01,89.61 38.48,90.15 37.72,90.15 35.2,87.63 27.94,87.63 v27.99,87.58
  Bottom 0.305: A1.13 54.94,75.57 53.72,76.79 52.07,76.79 50.97,77.89 v50.83,77.89 | R14.2 11.18,82.86 9.54,82.86 8.83,83.57 8.83,87.83 11,90 26.34,90 27.99,88.34 v27.99,87.58
  Bottom 0.406: R14.2 15.38,82.5 J2.5
CMD
  Bottom 0.406: J2.3 17.59,82.74 17.78,82.55 19.8,82.55 31.04,71.31 R9.2 35,71.76 A1.23
D+  (via drill 0.51)
  Top 0.305: v10.02,52.21 v11.43,50.8
  Bottom 0.305: U2.5 15.62,66.19 19.2,62.61 19.2,59.31 11.43,51.53 v11.43,50.8 | J1.D+ 7.75,49.66 10.16,52.07 v10.02,52.21
D-
  Bottom 0.305: U2.6 14.35,66.67 18.65,62.38 18.65,59.54 8.76,49.66 8.75,49.66 8.33,49.24 8.33,49.23 8.11,49.01 J1.D-
D/C  (via drill 0.51)
  Top 0.406: TFT_DISPLAY.P$4 24.71,71.72 32.13,71.72 36.56,76.15 40.37,76.15 40.64,75.88 v53.34,75.88
  Bottom 0.406: v53.34,75.88 53.34,74.93 53.98,74.3 A1.14
DAT0
  Bottom 0.406: A1.24 32.45,73.03 R13.2 30.67,74.68 30.61,74.68 18.37,86.92 13.87,86.92 13.19,86.23 J2.7
DIN  (via drill 0.51)
  Top 0.305: v39.37,74.93 39.37,62.23 v30.48,53.34 | J3.3 40.64,22.86 40.64,37.67 37.86,40.45 37.86,43.94 38.09,44.18 39.1,44.18 v40.64,45.72
  Bottom 0.305: A1.26 40.01,75.57 v39.37,74.93 | v30.48,53.34 38.1,45.72 v40.64,45.72
DTR  (via drill 0.51)
  Top 0.406: v17.78,76.2 20.32,76.2 29.21,85.09 v36.83,85.09 v36.82,85.08
  Bottom 0.406: R20.2 34.6,84.31 | 34.6,84.31 Q3.2 | U2.13 16.89,75.31 v17.78,76.2 | v36.82,85.08 35.38,85.08 34.6,84.31
GND  (via drill 0.51)
  Bottom 0.406: R17.2 8.26,37.15 IC1.1 | C5.2 R12.1 69.41,82.68 C6.2 | C4.2 65.66,54.04 C1.2 62.16,49.53 U1.2 | J1.GND 6.19,50.96
  other vias: 20.32,46.99 33.02,46.99 27.94,33.02 28.45,68.07 29.21,78.74 15.24,85.09 13.97,58.42 10.16,76.2 22.86,87.63 71.12,77.47 58.42,46.99 60.96,54.61 11.56,36.32 26.67,80.01
  pour Top (isolate 0.305): -1.27,101.6 78.74,101.6 78.74,-2.54 0,-2.54 -1.27,-1.27
  pour Bottom (isolate 0.305): -2.54,102.87 81.28,102.87 81.28,-5.08 -5.08,-5.08 -5.08,100.33
IO0  (via drill 0.51)
  Top 0.406: v39.37,82.55 41.91,80.01 v45.72,80.01 | v45.72,73.66 v45.72,72.39 | SELECT.1 9.55,46.38 10.16,46.99 v10.14,46.99
  Bottom 0.305: Q3.3 35.58,82.23 R19.1 | v10.14,46.99 26.67,63.52 26.67,64.77 27.94,66.04 43.18,66.04 45.72,68.58 v45.72,72.39
  Bottom 0.406: R19.1 37.15,82.55 v39.37,82.55 | v45.72,80.01 v45.72,73.66 | v45.72,72.39 43.81,74.3 A1.25
IO34  (via drill 0.51)
  Top 0.406: LEFT.1 6.66,26.75 6.66,26.27 7.22,25.7 10.56,25.7 11.12,26.27 11.12,26.75 LEFT.2 12.64,26.35 R8.2 17.46,26.35 17.78,26.67 R6.2 22.02,30.59 27.17,30.59 29.95,33.37 29.95,38.52 62.23,70.8 v62.23,83.82
  Bottom 0.406: v62.23,83.82 61.59,84.46 A1.6
IO35  (via drill 0.51)
  Top 0.305: v54.61,80.01 55.12,79.5 55.12,76.2 55.12,75.96 55.12,73.69 24.61,43.18 22.34,43.18 14.82,35.66 12.81,35.66 12.6,35.45 12.6,34.4 13.72,33.28 UP.2
  Top 0.406: UP.2 UP.1 22.48,34.29 R5.2 R7.2
  Bottom 0.305: v54.61,80.01 57.79,83.19 A1.7
LCD_CS  (via drill 0.51)
  Top 0.406: v36.83,74.93 32.81,70.91 TFT_DISPLAY.P$5
  Bottom 0.406: A1.29 40.01,79.38 36.83,76.2 v36.83,74.93
LCK  (via drill 0.51)
  Top 0.305: v57.15,80.01 60.31,83.17 60.31,84.13 61.58,85.39 62.88,85.39 65.05,83.23 65.05,29.21 65.05,28.93 65.05,28.8 65.41,28.45 70.99,28.45 72.01,27.43 72.01,22.48 71.37,21.84 41.91,21.84 J3.4
  Bottom 0.305: A1.10 57.78,79.38 v57.15,80.01
MENU  (via drill 0.51)
  Top 0.406: MENU.1 56.03,46.23 56.03,62.23 57.19,63.39 v57.19,63.46
  Bottom 0.406: v57.19,63.46 57.19,70.4 58.55,71.76 A1.16
MOSI  (via drill 0.51)
  Top 0.406: v38.1,89.23 34.62,85.75 25.96,85.75 16.82,76.6 16.82,75.8 18.65,73.97 20.86,73.97 22.1,72.72 22.1,70.1 TFT_DISPLAY.P$6
  Bottom 0.406: A1.37 38.74,89.54 38.13,88.93 38.1,88.93 v38.1,89.23
N$1
  Bottom 0.305: 69.85,48.26 69.85,49.53 71.12,49.53 SW1.S
  Bottom 0.406: U1.1 60.49,50.48 59.98,49.97 59.98,48.14 60.22,47.9 67.81,47.9 68.17,48.26 69.85,48.26 72.39,45.72 D2.C 69.1,42.99 T1.2
N$2  (via drill 0.51)
  Top 0.406: v29.21,63.12 28.62,63.71 TFT_DISPLAY.P$14 TFT_DISPLAY.P$13 TFT_DISPLAY.P$12 TFT_DISPLAY.P$11
  Bottom 0.406: R2.2 29.53,63.44 v29.21,63.12
N$3
  Bottom 0.305: U1.3 67.63,48.58 70.5,51.45 SW1.P
N$4
  Bottom 0.406: R2.1 31.43,62.38 Q1.3
N$5
  Bottom 0.406: U2.7 13.08,63.63 11.83,62.38 11.83,61.36 X1.X1 11.24,58.61 C7.1
N$6
  Bottom 0.406: U2.8 11.24,66.98 C8.1 11.24,63.31 X1.X2
N$7
  Top 0.406: R6.1 18.62,25.29 18.7,25.29 18.8,25.4 20.32,25.4 21.34,26.42 RIGHT.1 RIGHT.2
N$8  (via drill 0.51)
  Top 0.406: DOWN.1 DOWN.2 20.17,20.55 20.17,24.04 20.89,24.77 27.18,24.77 34.29,31.88 v34.29,33.02 | v28.98,34.29 R5.1
  Bottom 0.406: v34.29,33.02 33.02,34.29 v28.98,34.29
N$9
  Bottom 0.406: R17.1 11.11,37.78 9.53,36.2 IC1.2
N$10  (via drill 0.51)
  Top 0.305: R15.2 2.54,68.9 5.88,65.56 7.62,63.82 7.95,63.49 7.95,41.06 9.55,39.46 9.55,28.6 v7.62,26.67
  Bottom 0.406: v7.62,26.67 9.53,28.57 IC1.7
N$11  (via drill 0.51)
  Top 0.305: R16.2 5.08,67.5 8.51,64.07 8.51,51.18 11.11,48.58 11.11,40.94
  Top 0.406: v10.16,26.67 10.16,39.99 11.11,40.94
  Bottom 0.406: v10.16,26.67 10.79,27.3 IC1.6
N$12
  Top 0.406: D1.C R15.1
N$13
  Top 0.406: D3.C R16.1
N$14  (via drill 0.51)
  Top 0.406: D3.A D1.A 2.54,76.81 1.38,75.65 1.38,68.84 7.24,62.99 7.24,45.21 5.21,43.18 v2.54,43.18
  Bottom 0.406: C10.1 2.86,39.37 | 2.86,39.37 R18.2 2.86,42.86 v2.54,43.18 | 2.86,39.37 11.81,39.37 12.7,38.48 12.7,35.13 IC1.4 12.06,33.39 12.32,33.14 12.32,30.36 12.05,30.09 9.04,30.09 8.77,29.82 8.77,29.51 IC1.8
N$15
  Bottom 0.406: Q2.1 32.21,84.09 R20.1
N$16
  Bottom 0.305: R21.1 31.58,81.28 Q3.1
RESET  (via drill 0.51)
  Top 0.305: v38.1,85.09 38.1,78.48 | TFT_DISPLAY.P$2 27.91,73.31 27.98,73.38
  Top 0.406: v57.15,87.63 48,78.48 38.1,78.48 33.08,78.48 27.98,73.38
  Bottom 0.305: Q2.3 37,86.19 v38.1,85.09
  Bottom 0.406: v57.15,87.63 57.78,88.27 A1.3 60.02,87.86 71.28,87.86 74.93,84.2 74.93,60.96 71.69,60.96 C1.1 66.3,55.94 R1.1
RTS  (via drill 0.51)
  Top 0.406: v19.05,74.93 24.13,74.93 v27.94,78.74
  Bottom 0.305: Q2.2 R21.2
  Bottom 0.406: U2.14 18.16,74.04 v19.05,74.93 | v27.94,78.74 27.94,80.96 R21.2
RX
  Bottom 0.305: 31.11,87 37.71,87 38.99,85.72 38.99,85.73 A1.34
  Bottom 0.406: U2.2 19.43,68.2 16.76,70.87 10.29,70.87 5.97,75.18 5.97,86.11 10.67,90.81 27.3,90.81 31.11,87
SCK  (via drill 0.51)
  Top 0.406: v36.78,77.52 31.77,72.51 TFT_DISPLAY.P$3
  Bottom 0.406: v36.78,77.52 36.86,77.6 36.91,77.6 40.06,80.74 41.9,80.74 A1.30
SCL  (via drill 0.51)
  Top 0.406: v38.1,92.71 v35.56,90.17
  Bottom 0.406: J4.1 31.29,92.71 v38.1,92.71 | v35.56,90.17 37.46,88.27 A1.36
SDA  (via drill 0.51)
  Top 0.406: v45.72,83.82 40.64,88.9 v40.64,96.52
  Bottom 0.406: J4.2 34.56,96.52 v40.64,96.52 | v45.72,83.82 45.08,84.46 A1.33
START  (via drill 0.51)
  Top 0.305: v55.88,83.19 55.88,73.66 24.13,41.91 24.13,39.37 26.35,37.15 R10.1
  Top 0.406: START.1 24.13,41.91
  Bottom 0.305: A1.4 58.93,87 55.88,83.95 v55.88,83.19
TX
  Bottom 0.305: 10.16,91.44 27.94,91.44 31.82,87.56 37.95,87.56 38.5,87 A1.35
  Bottom 0.406: U2.3 18.16,68.2 16.51,69.85 10.16,69.85 5.08,74.93 5.08,86.36 10.16,91.44
VBAT  (via drill 0.51)
  Top 0.406: v69.85,40.64 73.66,44.45 73.66,49.61 72.93,50.34 72.93,54.05 73.66,54.78 v73.66,62.23
  Bottom 0.406: R11.2 71.12,81.21 C6.1 74.27,78.06 74.27,62.23 v73.66,62.23 | C9.1 5.19,24.34 | 5.19,24.34 CN1.1 | 5.19,24.34 7.93,24.34 8.52,24.93 10.83,24.93 12.06,26.16 IC1.5 18.62,35.56 33.12,35.56 33.98,36.43 33.98,37.8 39.37,43.18 53.34,43.18 60.96,35.56 73.66,35.56 74.93,36.83 74.93,40.64 v69.85,40.64 67.41,38.2 T1.1
VBUS
  Bottom 0.406: J1.VBUS 6.25,48.36 6.35,48.26 6.35,44.45 | 6.35,44.45 6.35,42.23 R18.1 | D2.A 71.34,37.24 T1.3 60.81,37.24 53.59,44.45 52.7,44.45 | 6.35,44.45 52.7,44.45 | R4.2 52.39,44.77 52.7,44.45

### Text on the board
Top: ESPlay 2.0